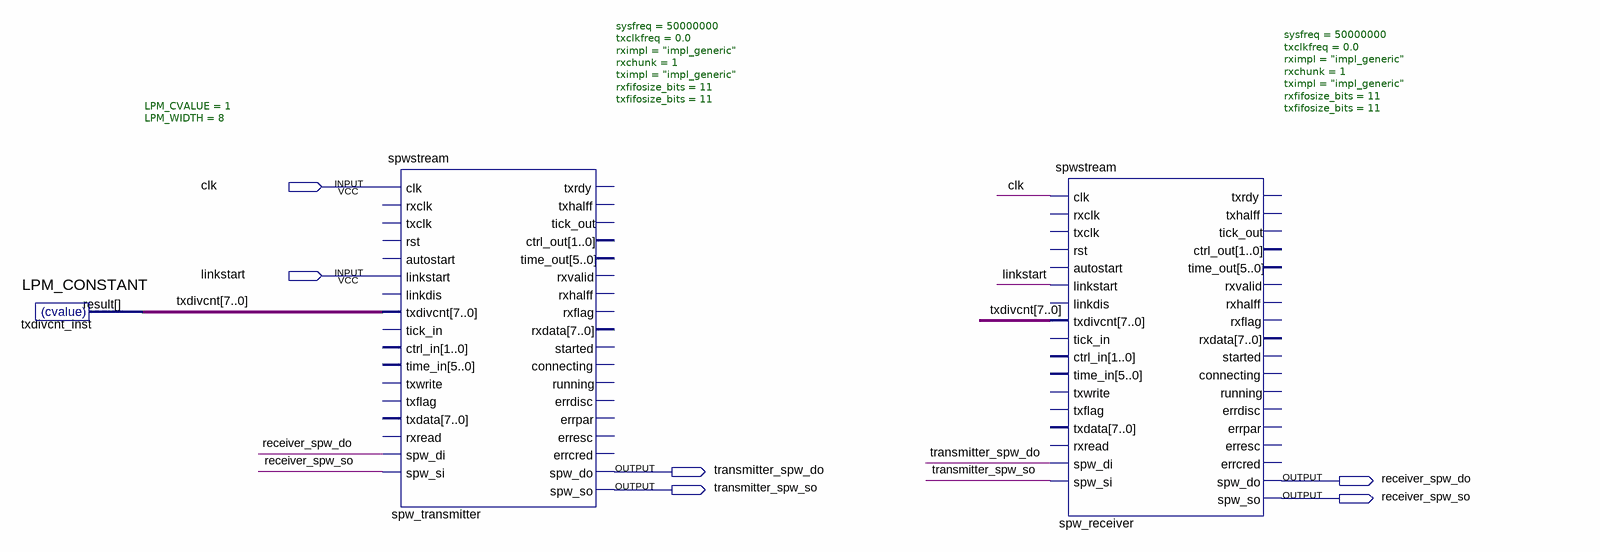
[diagram p0: schematic sheet]
// Quartus schematic sw.bdf as structural Verilog: 3 symbols, 6 pins
module sw (
  input  clk,
  input  linkstart,
  output transmitter_spw_do,
  output receiver_spw_do,
  output transmitter_spw_so,
  output receiver_spw_so
);

  wire [7:0] txdivcnt;

  LPM_CONSTANT #(.LPM_CVALUE(1), .LPM_WIDTH(8)) txdivcnt_inst (.result(txdivcnt));
  spwstream #(.sysfreq(50000000), .txclkfreq(0.0), .rximpl("impl_generic"), .rxchunk(1), .tximpl("impl_generic"), .rxfifosize_bits(11), .txfifosize_bits(11)) spw_transmitter (
    .clk(clk), .linkstart(linkstart), .txdivcnt(txdivcnt), .spw_di(receiver_spw_do),
    .spw_si(receiver_spw_so), .spw_do(transmitter_spw_do), .spw_so(transmitter_spw_so));  // open: rxclk, txclk, rst, autostart, linkdis, tick_in, ctrl_in, time_in, txwrite, txflag, txdata, rxread, txrdy, txhalff, tick_out, ctrl_out, time_out, rxvalid, rxhalff, rxflag, rxdata, started, connecting, running, errdisc, errpar, erresc, errcred
  spwstream #(.sysfreq(50000000), .txclkfreq(0.0), .rximpl("impl_generic"), .rxchunk(1), .tximpl("impl_generic"), .rxfifosize_bits(11), .txfifosize_bits(11)) spw_receiver (
    .clk(clk), .linkstart(linkstart), .txdivcnt(txdivcnt), .spw_di(transmitter_spw_do),
    .spw_si(transmitter_spw_so), .spw_do(receiver_spw_do), .spw_so(receiver_spw_so));  // open: rxclk, txclk, rst, autostart, linkdis, tick_in, ctrl_in, time_in, txwrite, txflag, txdata, rxread, txrdy, txhalff, tick_out, ctrl_out, time_out, rxvalid, rxhalff, rxflag, rxdata, started, connecting, running, errdisc, errpar, erresc, errcred
endmodule
